# EAGLE schematic jkw_hdmi (EAGLE 6.5.0)
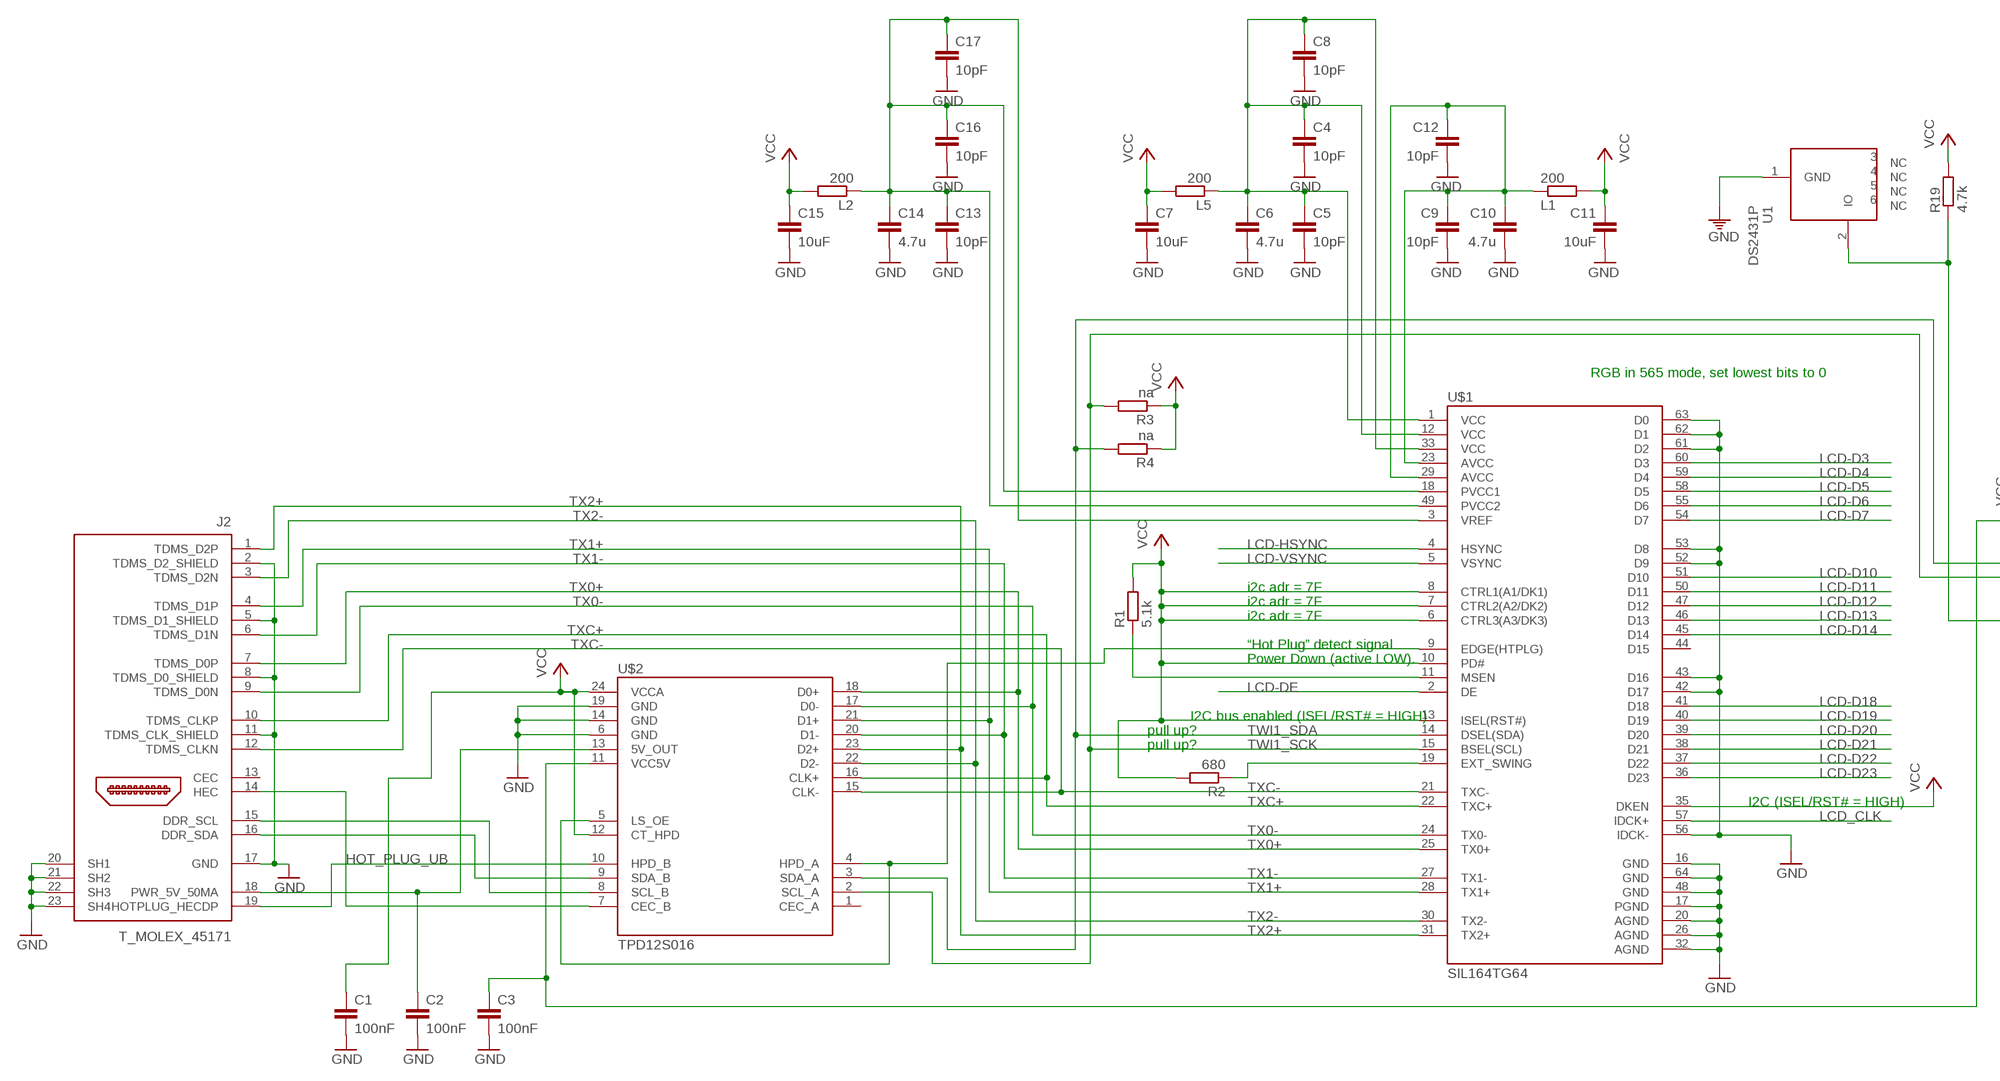
[diagram p0: schematic, sheet 1, part 1 of 2]
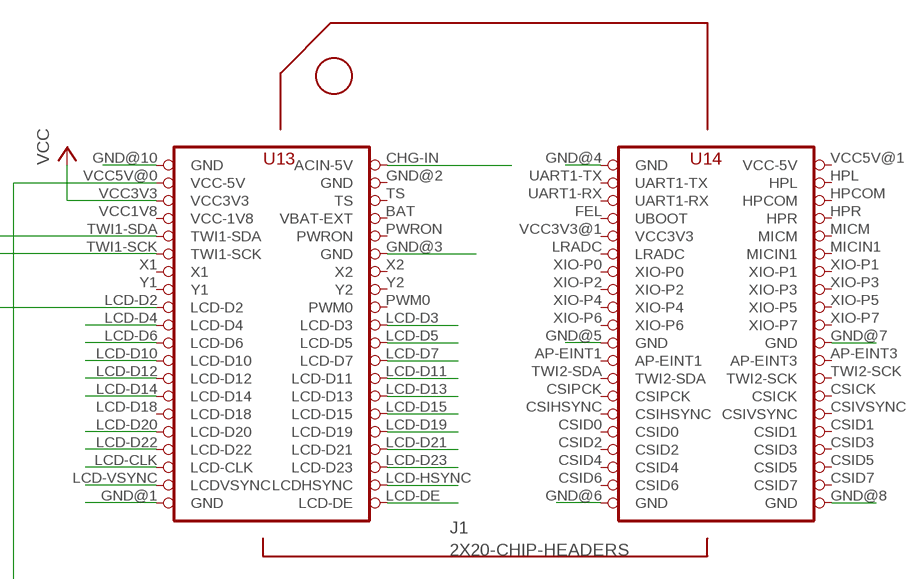
[diagram p1: schematic, sheet 1, part 2 of 2]

## Parts
C1  100nF  C-EUC0805  [C0805]
C2  100nF  C-EUC0805  [C0805]
C3  100nF  C-EUC0805  [C0805]
C4  10pF  C-EUC0805  [C0805]
C5  10pF  C-EUC0805  [C0805]
C6  4.7u  C-EUC0805  [C0805]
C7  10uF  C-EUC0805  [C0805]
C8  10pF  C-EUC0805  [C0805]
C9  10pF  C-EUC0805  [C0805]
C10  4.7u  C-EUC0805  [C0805]
C11  10uF  C-EUC0805  [C0805]
C12  10pF  C-EUC0805  [C0805]
C13  10pF  C-EUC0805  [C0805]
C14  4.7u  C-EUC0805  [C0805]
C15  10uF  C-EUC0805  [C0805]
C16  10pF  C-EUC0805  [C0805]
C17  10pF  C-EUC0805  [C0805]
J1  2X20-CHIP-HEADERS  [2X20CHIP_SM]
J2  T_MOLEX_45171  [T_MOLEX_45171]
L1  200  R-EU_R0805  [R0805]
L2  200  R-EU_R0805  [R0805]
L5  200  R-EU_R0805  [R0805]
R1  5.1k  R-EU_M0805  [M0805]
R2  680  R-EU_M0805  [M0805]
R3  na  R-EU_M0805  [M0805]
R4  na  R-EU_M0805  [M0805]
R19  4.7k  R-EU_R0805  [R0805]
U1  DS2431P  [TSOC6]
U$1  SIL164TG64  [TQFP64]
U$2  TPD12S016  [DIL24]

## Nets
ASD: R1.1 U$1.11(MSEN)
GND: C1.2 C2.2 C3.2 C4.2 C5.2 C6.2 C7.2 C8.2 C9.2 C10.2 C11.2 C12.2 C13.2 C14.2 C15.2 C16.2 C17.2 J1.GND@1(GND) J1.GND@3(GND) J1.GND@4(GND) J1.GND@5(GND) J1.GND@6(GND) J1.GND@7(GND) J1.GND@8(GND) J1.GND@10(GND) J2.2(TDMS_D2_SHIELD) J2.5(TDMS_D1_SHIELD) J2.8(TDMS_D0_SHIELD) J2.11(TDMS_CLK_SHIELD) J2.17(GND) J2.20(SH1) J2.21(SH2) J2.22(SH3) J2.23(SH4) U1.1(GND) U$1.16(GND) U$1.17(PGND) U$1.20(AGND) U$1.26(AGND) U$1.32(AGND) U$1.42(D17) U$1.43(D16) U$1.48(GND) U$1.52(D9) U$1.53(D8) U$1.56(IDCK-) U$1.61(D2) U$1.62(D1) U$1.63(D0) U$1.64(GND) U$2.6(GND) U$2.14(GND) U$2.19(GND)
HOT_PLUG_UB: J2.19(HOTPLUG_HECDP) U$2.10(HPD_B)
HOTPLUG_DET: U$1.9(EDGE(HTPLG)) U$2.4(HPD_A) U$2.5(LS_OE)
LCD-D3: J1.LCD-D3 U$1.60(D3)
LCD-D4: J1.LCD-D4 U$1.59(D4)
LCD-D5: J1.LCD-D5 U$1.58(D5)
LCD-D6: J1.LCD-D6 U$1.55(D6)
LCD-D7: J1.LCD-D7 U$1.54(D7)
LCD-D10: J1.LCD-D10 U$1.51(D10)
LCD-D11: J1.LCD-D11 U$1.50(D11)
LCD-D12: J1.LCD-D12 U$1.47(D12)
LCD-D13: J1.LCD-D13 U$1.46(D13)
LCD-D14: J1.LCD-D14 U$1.45(D14)
LCD-D15: J1.LCD-D15
LCD-D18: U$1.41(D18)
LCD-D19: J1.LCD-D19 U$1.40(D19)
LCD-D20: J1.LCD-D20 U$1.39(D20)
LCD-D21: J1.LCD-D21 U$1.38(D21)
LCD-D22: J1.LCD-D22 U$1.37(D22)
LCD-D23: J1.LCD-D23 U$1.36(D23)
LCD-DE: J1.LCD-DE U$1.2(DE)
LCD-HSYNC: J1.LCD-HSYNC(LCDHSYNC) U$1.4(HSYNC)
LCD-VSYNC: J1.LCD-VSYNC(LCDVSYNC) U$1.5(VSYNC)
LCD_CLK: J1.LCD-CLK U$1.57(IDCK+)
N$1: J1.CHG-IN(ACIN-5V)
N$2: R2.1 U$1.19(EXT_SWING)
N$3: C2.1 J2.18(PWR_5V_50MA) U$2.13(5V_OUT)
N$4: C4.1 C5.1 C6.1 C8.1 L5.1 U$1.1(VCC) U$1.12(VCC) U$1.33(VCC)
N$5: J1.LCD-D2 R19.1 U1.2(IO)
N$6: J2.15(DDR_SCL) U$2.8(SCL_B)
N$7: J2.16(DDR_SDA) U$2.9(SDA_B)
N$8: C9.1 C10.1 C12.1 L1.1 U$1.23(AVCC) U$1.29(AVCC)
N$9: J2.14(HEC) U$2.7(CEC_B)
N$10: C13.1 C14.1 C16.1 C17.1 L2.1 U$1.3(VREF) U$1.18(PVCC1) U$1.49(PVCC2)
TWI1_SCK: J1.TWI1-SCK R3.2 U$1.15(BSEL(SCL)) U$2.2(SCL_A)
TWI1_SDA: J1.TWI1-SDA R4.2 U$1.14(DSEL(SDA)) U$2.3(SDA_A)
TX0+: J2.7(TDMS_D0P) U$1.25(TX0+) U$2.18(D0+)
TX0-: J2.9(TDMS_D0N) U$1.24(TX0-) U$2.17(D0-)
TX1+: J2.4(TDMS_D1P) U$1.28(TX1+) U$2.21(D1+)
TX1-: J2.6(TDMS_D1N) U$1.27(TX1-) U$2.20(D1-)
TX2+: J2.1(TDMS_D2P) U$1.31(TX2+) U$2.23(D2+)
TX2-: J2.3(TDMS_D2N) U$1.30(TX2-) U$2.22(D2-)
TXC+: J2.10(TDMS_CLKP) U$1.22(TXC+) U$2.16(CLK+)
TXC-: J2.12(TDMS_CLKN) U$1.21(TXC-) U$2.15(CLK-)
VCC: C1.1 C7.1 C11.1 C15.1 J1.VCC3V3 L1.2 L2.2 L5.2 R1.2 R2.2 R3.1 R4.1 R19.2 U$1.6(CTRL3(A3/DK3)) U$1.7(CTRL2(A2/DK2)) U$1.8(CTRL1(A1/DK1)) U$1.10(PD#) U$1.13(ISEL(RST#)) U$1.35(DKEN) U$2.12(CT_HPD) U$2.24(VCCA)
VCC_5V_DCC: C3.1 J1.VCC5V@0(VCC-5V) U$2.11(VCC5V)
Unconnected: J1.AP-EINT1 J1.AP-EINT3 J1.BAT(VBAT-EXT) J1.CSICK J1.CSID0 J1.CSID1 J1.CSID2 J1.CSID3 J1.CSID4 J1.CSID5 J1.CSID6 J1.CSID7 J1.CSIHSYNC J1.CSIPCK J1.CSIVSYNC J1.FEL(UBOOT) J1.HPCOM J1.HPL J1.HPR J1.LCD-D18 J1.LRADC J1.MICIN1 J1.MICM J1.PWM0 J1.PWRON J1.TS J1.TWI2-SCK J1.TWI2-SDA J1.UART1-RX J1.UART1-TX J1.X1 J1.X2 J1.XIO-P0 J1.XIO-P1 J1.XIO-P2 J1.XIO-P3 J1.XIO-P4 J1.XIO-P5 J1.XIO-P6 J1.XIO-P7 J1.Y1 J1.Y2 J2.13(CEC) U1.3(NC) U1.4(NC) U1.5(NC) U1.6(NC) U$2.1(CEC_A)

## Notes on the sheet
- RGB in 565 mode, set lowest bits to 0
- i2c adr = 7F
- i2c adr = 7F
- i2c adr = 7F
- “Hot Plug” detect signal
- Power Down (active LOW).
- I2C bus enabled (ISEL/RST# = HIGH)
- pull up?
- pull up?
- I2C (ISEL/RST# = HIGH)

## Power pins joined to a net without a drawn wire
D15: U$1.44(D15)
GND: J1.GND@2(GND)
VCC3V3: J1.VCC3V3@1(VCC3V3)
VCC-1V8: J1.VCC1V8(VCC-1V8)
VCC-5V: J1.VCC5V@1(VCC-5V)

## Library data of the parts
C1-C17 = rcl:C-EU: CAPACITOR, European symbol
J1 = VGA-DIP:2X20-CHIP-HEADERS: Through hole layout with chip reference
J2 = CHIP_HDMI:T_MOLEX_45171
L1 L2 L5 R1-R4 R19 = rcl:R-EU_: RESISTOR, European symbol
U1 = VGA-DIP:DS2431: 1024-Bit EEPROM This chip provides a 4x256 Bit EEPROM, which can be programmed@5V. Write protection and OTP emulation are available, too. Author: Jan Kandziora <jjj@gmx.de>; DESCRIPTION: IC, 1024-Bit, 1-Wire EEPROM, TSOC6; FOOTPRINT: TSOC6; LINK: http://www.digikey.com/product-detail/en/DS2431P%2BT%26R/DS2431P%2BT%26RCT-ND/3647900; MFG: DIGIKEY; MFG_PN: DS2431P+T&RCT-ND; PART_TYPE: IC; PRICE: 0.98; VENDOR: MAXIM; VENDOR_PART_NUMBER: DS2431P+T&R
U$1 = SII164CTG64:SIL164TG64
U$2 = SII164CTG64:TPD12S016